# EasyEDA Pro project ProPrj_IoT House_2026-04-28.epro, schematic Schematic1
Board Name: LED_Module; Create Date: 2026-01-06; Page Name: P1; Project Name: IoT House; Schematic Name: Schematic1; Update Date: 2026-01-17; Company: EasyEDA.com; Page Size: A4; Version: V1.0
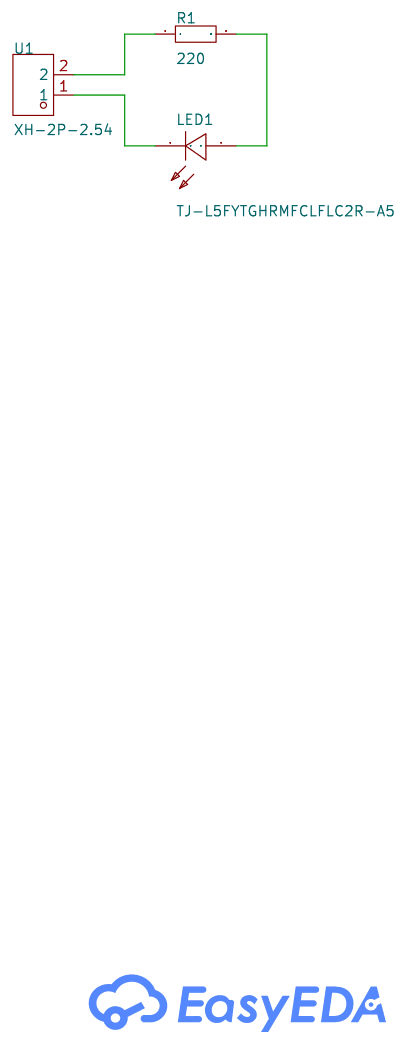
[diagram p0: schematic sheet]

## Parts
LED1  TJ-L5FYTGHRMFCLFLC2R-A5  [LED-TH_BD5.8-P2.54-FD_RED]
R1  220  [R_AXIAL-0.4]
U1  XH-2P-2.54  [CONN-TH_2P-P2.50-XH2.54-2P]

## Library data of the parts
LED1 = TJ-L5FYTGHRMFCLFLC2R-A5: Lamp Holder Type:5mm Round Lens Illumination Color:Red Voltage - Forward(Vf):2.5V Voltage - Forward(Vf):2.5V Power(Watts):72mW Forward Current:20mA Wavelength - Dominant:630nm Wavelength - Dominant:630nm Peak Wavelength:630nm Lens Color:Diffused Red Lens; LCSC Part Name: 红灯; Supplier Part: C330739; Manufacturer: TOGIALED(统佳); Supplier Footprint: 插件,D=5mm; JLCPCB Part Class: Extended Part; Datasheet: https://item.szlcsc.com/datasheet/TJ-L5FYTGHRMFCLFLC2R-A5/310352.html; Supplier: LCSC; Lamp Holder Type: 5mm Round Lens; Illumination Color: Red; Voltage - Forward(Vf): 2.5V; Power(Watts): 72mW; Forward Current: 20mA; Wavelength - Dominant: 630nm; Peak Wavelength: 630nm; Lens Color: Diffused Red Lens; Luminous Intensity: 300mcd; Viewing Angle: 45°; Operating Temperature: -20℃~+80℃
R1 = Res_AXIAL-1/4W: Supplier Footprint: Through
U1 = XH-2P-2.54: Supplier Part: C9900003929; Supplier Footprint: TH-2P; JLCPCB Part Class: Extended Part; Supplier: LCSC

## Nets
Net-(LED1-1): LED1.1 R1.2
Net-(LED1-2): LED1.2 U1.1
Net-(R1-1): R1.1 U1.2
